# EAGLE design project2 (EAGLE 9.6.2)
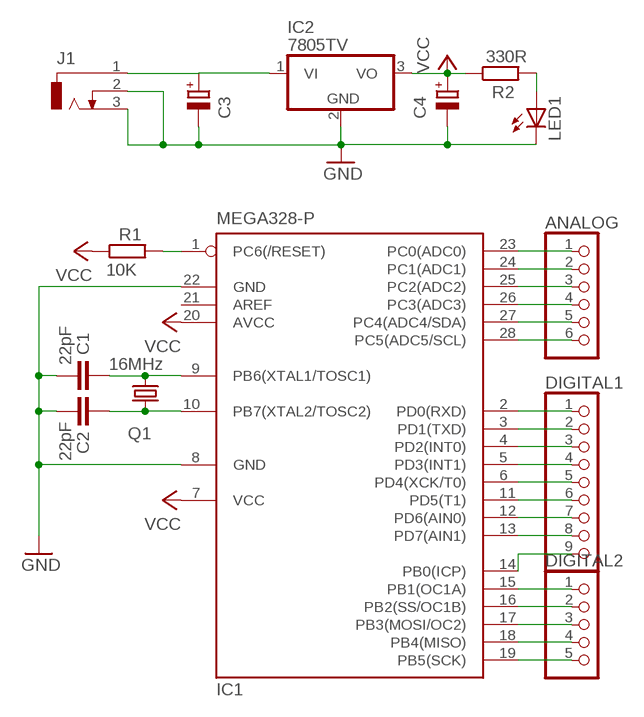
[diagram p0: schematic, sheet 1]

## Parts
ANALOG  PINHD-1X6  [1X06]
C1  22pF  C-EU025-024X044  [C025-024X044]
C2  22pF  C-EU025-024X044  [C025-024X044]
C3  CPOL-EUE2.5-6  [E2,5-6]
C4  CPOL-EUE2.5-6  [E2,5-6]
DIGITAL1  PINHD-1X9  [1X09]
DIGITAL2  PINHD-1X5  [1X05]
IC1  MEGA328-P  MEGA8-P  [DIL28-3]
IC2  7805TV  [TO220V]
J1  DCJ0303  [DCJ0303]
LED1  LED3MM  [LED3MM]
Q1  16MHz  CRYSTALHC49U70  [HC49U70]
R1  10K  R-EU_0207/10  [0207/10]
R2  330R  R-EU_0207/10  [0207/10]

## Nets
GND: C1.2 C2.2 C3.- C4.- IC1.8(GND) IC1.22(GND) IC2.2(GND) J1.2 J1.3 LED1.K(C)
N$1: IC1.1(PC6(/RESET)) R1.2
N$2: C1.1 IC1.9(PB6(XTAL1/TOSC1)) Q1.1
N$3: C2.1 IC1.10(PB7(XTAL2/TOSC2)) Q1.2
N$4: ANALOG.1 IC1.23(PC0(ADC0))
N$5: ANALOG.2 IC1.24(PC1(ADC1))
N$6: ANALOG.3 IC1.25(PC2(ADC2))
N$7: ANALOG.4 IC1.26(PC3(ADC3))
N$8: ANALOG.5 IC1.27(PC4(ADC4/SDA))
N$9: ANALOG.6 IC1.28(PC5(ADC5/SCL))
N$10: DIGITAL1.1 IC1.2(PD0(RXD))
N$11: DIGITAL1.2 IC1.3(PD1(TXD))
N$12: DIGITAL1.3 IC1.4(PD2(INT0))
N$13: DIGITAL1.4 IC1.5(PD3(INT1))
N$14: DIGITAL1.5 IC1.6(PD4(XCK/T0))
N$15: DIGITAL1.6 IC1.11(PD5(T1))
N$16: DIGITAL1.7 IC1.12(PD6(AIN0))
N$17: DIGITAL1.8 IC1.13(PD7(AIN1))
N$18: DIGITAL1.9 IC1.14(PB0(ICP))
N$19: DIGITAL2.1 IC1.15(PB1(OC1A))
N$20: DIGITAL2.2 IC1.16(PB2(SS/OC1B))
N$21: DIGITAL2.3 IC1.17(PB3(MOSI/OC2))
N$22: DIGITAL2.4 IC1.18(PB4(MISO))
N$23: DIGITAL2.5 IC1.19(PB5(SCK))
N$24: C3.+ IC2.1(VI) J1.1
N$28: LED1.A R2.2
VCC: C4.+ IC1.7(VCC) IC1.20(AVCC) IC2.3(VO) R1.1 R2.1
Unconnected: IC1.21(AREF)

## Library data of the parts
ANALOG = pinhead:PINHD-1X6: PIN HEADER
C1 C2 = rcl:C-EU: CAPACITOR, European symbol; SPICEPREFIX: C
C3 C4 = rcl:CPOL-EU: POLARIZED CAPACITOR, European symbol; SPICEPREFIX: C
DIGITAL1 = pinhead:PINHD-1X9: PIN HEADER
DIGITAL2 = pinhead:PINHD-1X5: PIN HEADER
IC1 = atmel:MEGA8-P: MICROCONTROLLER 8 Kbytes FLASH, 1 kbytes SRAM, 512 bytes EEPROM, USART, 4-channel 10 bit ADC, 2-channel 8 bit ADC Pin compatible with Atmega48, ATMega88, ATMega168 Source: avr.lbr; OC_FARNELL: unknown; OC_NEWARK: unknown
IC2 = linear:78*: Positive VOLTAGE REGULATOR Source: http://cache.national.com/ds/LM/LM78L05.pdf http://www.fairchildsemi.com/ds/LM/LM7805.pdf
J1 = con-jack:DCJ0303: DC POWER JACK Source: DCJ0303.pdf; OC_FARNELL: unknown; OC_NEWARK: unknown
LED1 = led:LED: LED OSRAM: - CHIPLED LG R971, LG N971, LY N971, LG Q971, LY Q971, LO R971, LY R971 LH N974, LH R974 LS Q976, LO Q976, LY Q976 LO Q996 - Hyper CHIPLED LW Q18S LB Q993, LB Q99A, LB R99A - SideLED LS A670, LO A670, LY A670, LG A670, LP A670 LB A673, LV A673, LT A673, LW A673 LH A674 LY A675 LS A676, LA A676, LO A676, LY A676, LW A676 LS A679, LY A679, LG A679 - Hyper Micro SIDELED® LS Y876, LA Y876, LO Y876, LY Y876 LT Y87S - SmartLED LW L88C, LW L88S LB L89C, LB L89S, LG L890 LS L89K, LO L89K, LY L89K LS L896, LA L896, LO L896, LY L896 - TOPLED LS T670, LO T670, LY T670, LG T670, LP T670 LSG T670, LSP T670, LSY T670, LOP T670, LYG T670 LG T671, LOG T671, LSG T671 LB T673, LV T673, LT T673, LW T673 LH T674 LS T676, LA T676, LO T676, LY T676, LB T676, LH T676, LSB T676, LW T676 LB T67C, LV T67C, LT T67C, LS T67K, LO T67K, LY T67K, LW E67C LS E67B, LA E67B, LO E67B, LY E67B, LB E67C, LV E67C, LT E67C LW T67C LS T679, LY T679, LG T679 LS T770, LO T770, LY T770, LG T770, LP T770 LB T773, LV T773, LT T773, LW T773 LH T774 LS E675, LA E675, LY E675, LS T675 LS T776, LA T776, LO T776, LY T776, LB T776 LHGB T686 LT T68C, LB T68C - Hyper Mini TOPLED® LB M676 - Mini TOPLED Santana® LG M470 LS M47K, LO M47K, LY M47K Source: http://www.osram.convergy.de LUXEON: - LUMILED® LXK2-PW12-R00, LXK2-PW12-S00, LXK2-PW14-U00, LXK2-PW14-V00 LXK2-PM12-R00, LXK2-PM12-S00, LXK2-PM14-U00 LXK2-PE12-Q00, LXK2-PE12-R00, LXK2-PE12-S00, LXK2-PE14-T00, LXK2-PE14-U00 LXK2-PB12-K00, LXK2-PB12-L00, LXK2-PB12-M00, LXK2-PB14-N00, LXK2-PB14-P00, LXK2-PB14-Q00 LXK2-PR12-L00, LXK2-PR12-M00, LXK2-PR14-Q00, LXK2-PR14-R00 LXK2-PD12-Q00, LXK2-PD12-R00, LXK2-PD12-S00 LXK2-PH12-R00, LXK2-PH12-S00 LXK2-PL12-P00, LXK2-PL12-Q00, LXK2-PL12-R00 Source: www.luxeon.com KINGBRIGHT: KA-3528ASYC Source: www.kingbright.com
Q1 = crystal:CRYSTAL: CRYSTAL; OC_FARNELL: unknown; OC_NEWARK: unknown
R1 R2 = rcl:R-EU_: RESISTOR, European symbol; SPICEPREFIX: R

## Board
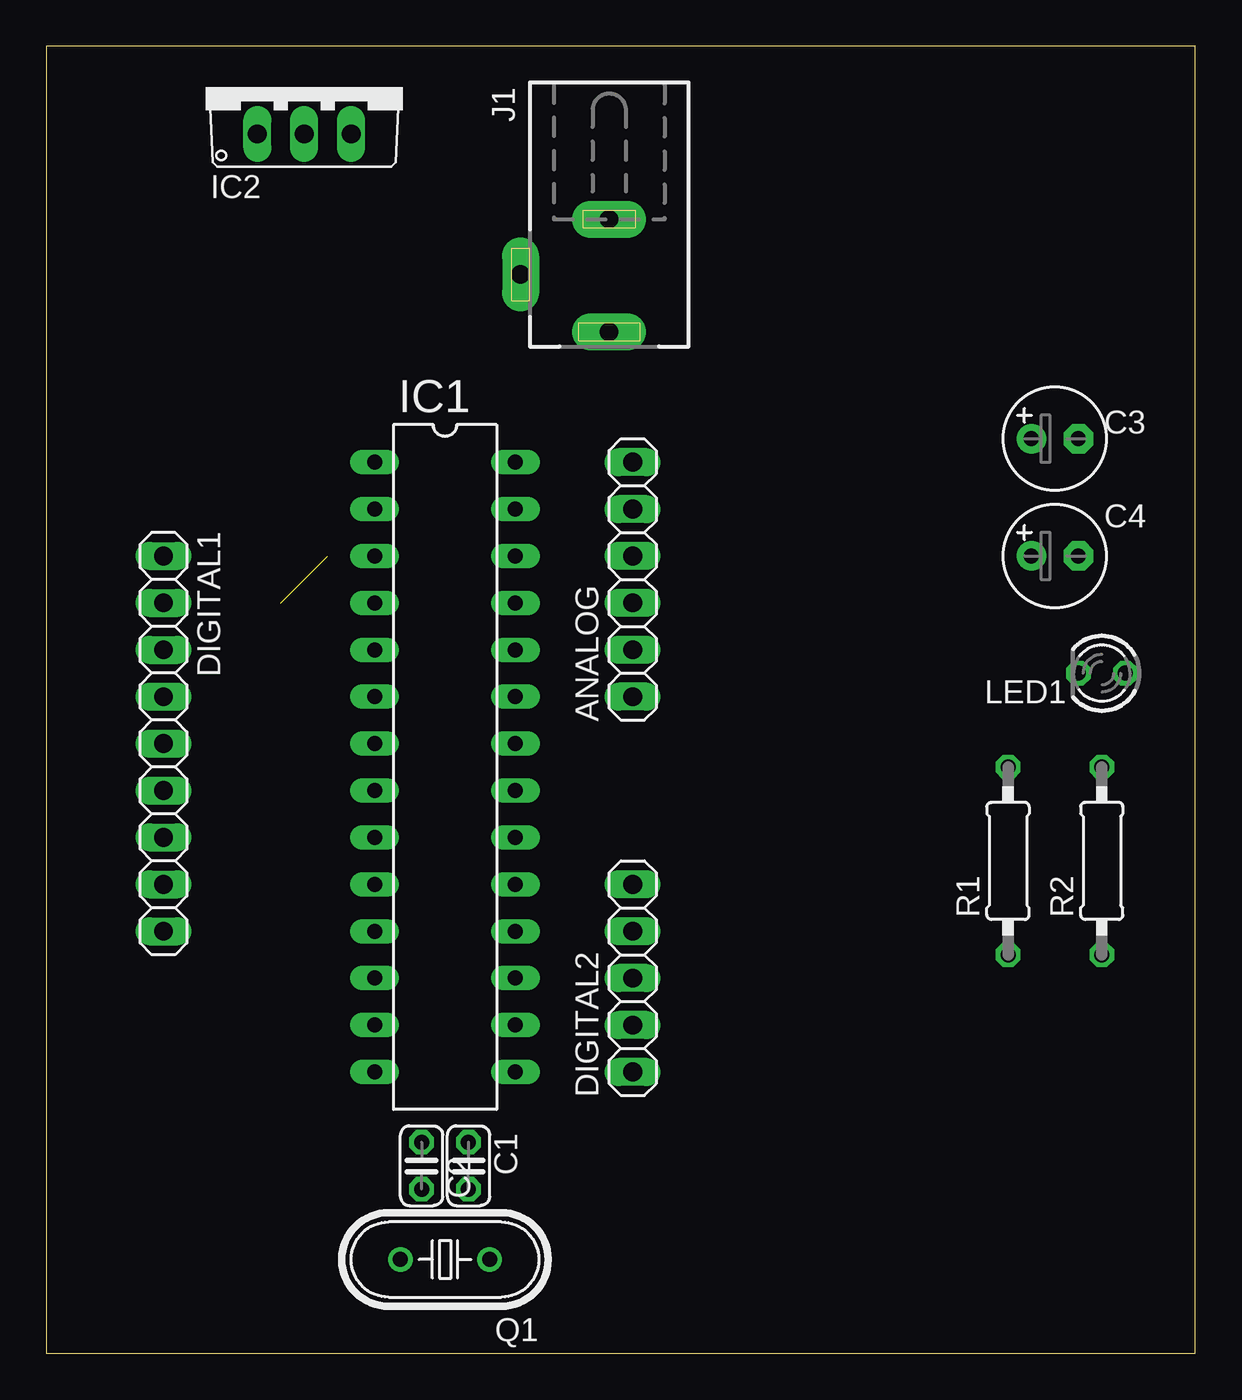
[diagram p1: board, top side]
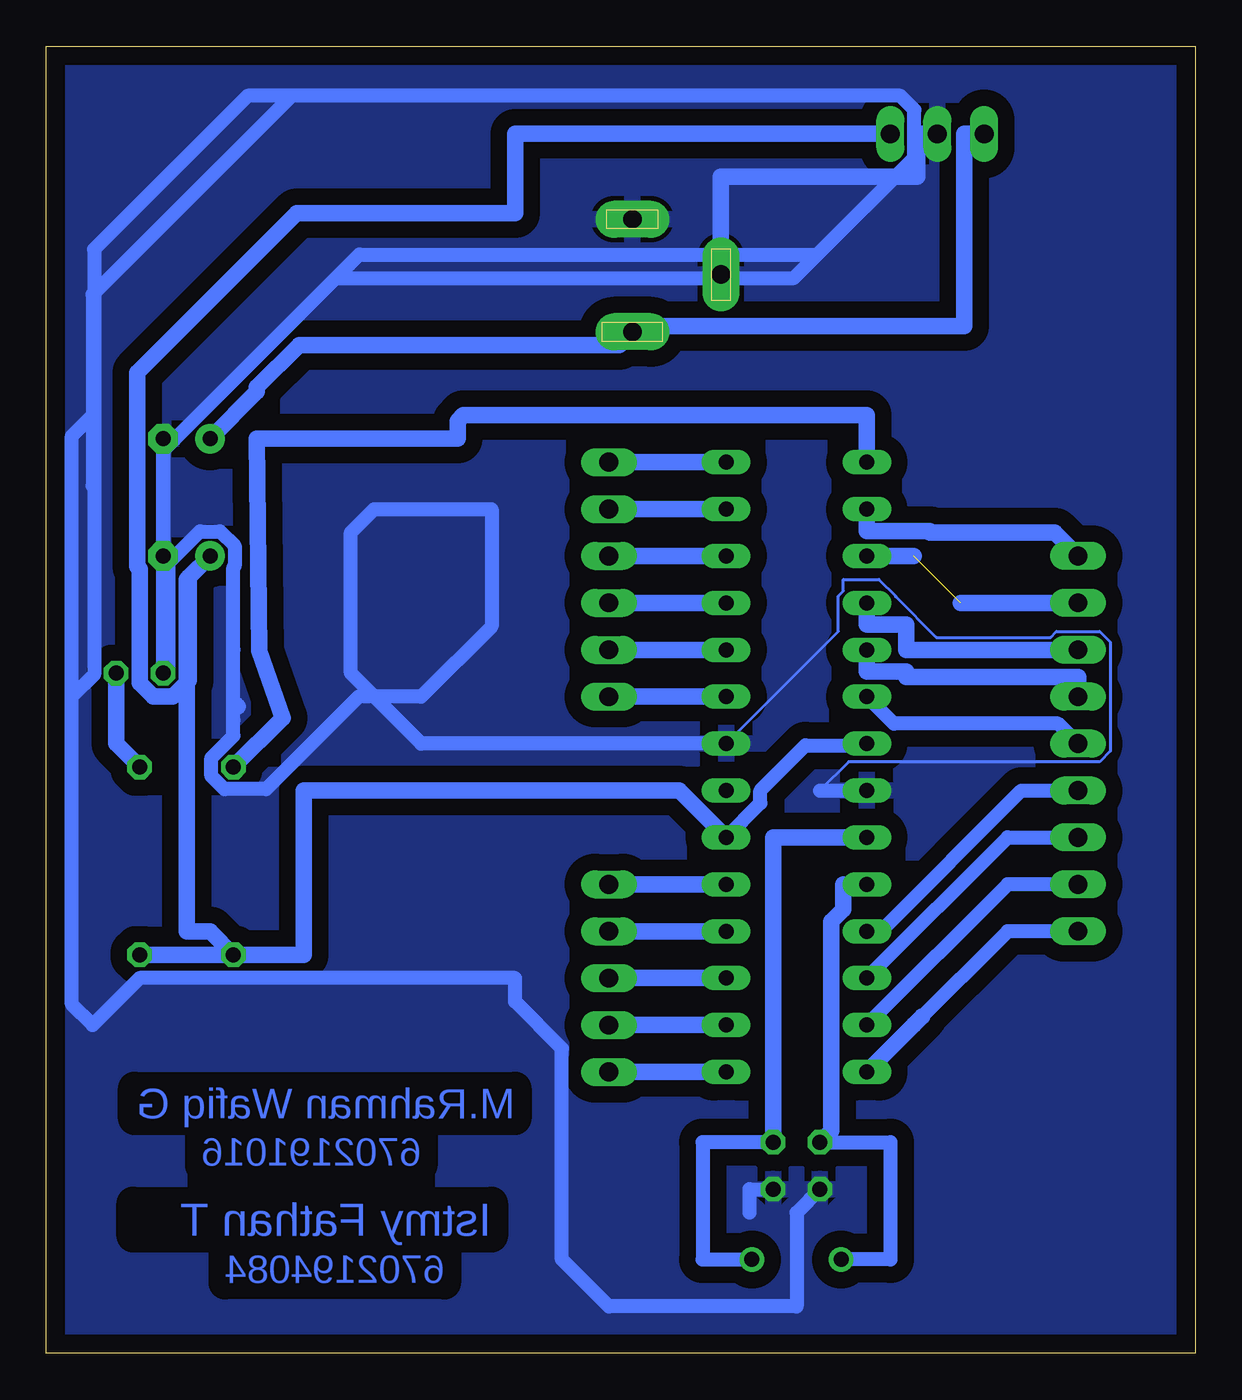
[diagram p2: board, bottom side, seen from below]

Size 62.21 x 70.79 mm. Coordinates in mm from the lower left corner, seen from the top.
Outline: 0,0 62.21,0 62.21,70.79 0,70.79 0,0
Copper layers (1*16): Top 0.035mm / dielectric 1.5mm / Bottom 0.035mm
Design rules "default": minimum track width 6mil, minimum drill 0.35mm, track to track 6mil, track to pad 6mil, pad to pad 6mil, via to via 6mil, smd to smd 6mil, copper to edge 40mil, drill to drill 6mil, minimum pad ring 10mil, minimum via ring 8mil, stop-mask expansion 4mil, vias tented up to drill 0mil, thermal gap 10mil

### Footprints (pad centres in the part's own frame; a part is rotated, then mirrored left to right if it is on the bottom)
1X06 = drill 1.016 long: 1 -6.35,0; 2 -3.81,0; 3 -1.27,0; 4 1.27,0; 5 3.81,0; 6 6.35,0
C025-024X044 = drill 0.813 octagon: 1 -1.27,0; 2 1.27,0
E2,5-6 = drill 0.813 pad 1.6: + -1.27,0 | drill 0.813 pad 1.6 octagon: - 1.27,0
1X09 = drill 1.016 long: 1 -10.16,0; 2 -7.62,0; 3 -5.08,0; 4 -2.54,0; 5 0,0; 6 2.54,0; 7 5.08,0; 8 7.62,0; 9 10.16,0
1X05 = drill 1.016 long: 1 -5.08,0; 2 -2.54,0; 3 0,0; 4 2.54,0; 5 5.08,0
DIL28-3 = drill 0.813 long: 1 -16.51,-3.81; 2 -13.97,-3.81; 3 -11.43,-3.81; 4 -8.89,-3.81; 5 -6.35,-3.81; 6 -3.81,-3.81; 7 -1.27,-3.81; 8 1.27,-3.81; 9 3.81,-3.81; 10 6.35,-3.81; 11 8.89,-3.81; 12 11.43,-3.81; 13 13.97,-3.81; 14 16.51,-3.81; 15 16.51,3.81; 16 13.97,3.81; 17 11.43,3.81; 18 8.89,3.81; 19 6.35,3.81; 20 3.81,3.81; 21 1.27,3.81; 22 -1.27,3.81; 23 -3.81,3.81; 24 -6.35,3.81; 25 -8.89,3.81; 26 -11.43,3.81; 27 -13.97,3.81; 28 -16.51,3.81
TO220V = drill 1.016 long: 1 -2.54,-2.54; 2 0,-2.54; 3 2.54,-2.54
DCJ0303 = drill 1 pad 2 long: 1 0,3.1; 2 4.8,0; 3 0,-3
LED3MM = drill 0.813 octagon: A -1.27,0; K 1.27,0
HC49U70 = drill 0.813: 1 -2.413,0; 2 2.413,0
0207/10 = drill 0.813 octagon: 1 -5.08,0; 2 5.08,0

### Placement (x,y rotation side)
ANALOG  31.75,41.91 90 top
C1  22.86,10.16 270 top
C2  20.32,10.16 270 top
C3  54.61,49.53 0 top
C4  54.61,43.18 0 top
DIGITAL1  6.35,33.02 270 top
DIGITAL2  31.75,20.32 90 top
IC1  21.59,31.75 270 top
IC2  13.97,68.58 0 top
J1  30.48,58.42 180 top
LED1  57.15,36.83 180 top
Q1  21.59,5.08 180 top
R1  52.07,26.67 90 top
R2  57.15,26.67 90 top

### Tracks (layer width: path | path; a pad name or v marks a point on that pad's centre or on a via)
GND
  Bottom 0.152: 20.32,30.48 18.77,32.03 5.18,32.03 4.6,32.61 4.6,38.51 5.18,39.09 7.52,39.09 7.84,38.77 14.02,38.77 16.23,40.98 16.23,41.01 17.13,41.91 19.05,41.91 19.05,41.29 19.33,41.01 19.33,39.09 IC1.22 25.17,33.02 | 52.31,38.34 52.07,38.1 | 52.31,38.34 52.31,43.61 52.91,44.21 53.77,44.21 55.28,42.69 55.28,37.43 LED1.K | 52.07,34.29 52.31,34.53 52.31,38.34
  Bottom 0.762: C3.- C4.- | C4.- 55.23,43.18 | 55.23,43.18 53.89,44.51 52.79,44.51 52.01,43.73 52.01,42.63 52.07,42.56 52.07,38.1 52.07,34.29 52.07,33.44 53.26,32.24 53.26,31.26 52.56,30.56 50.31,30.56 45.3,35.56 41.91,35.56 38.1,39.37 38.1,45.72 44.45,45.72 45.72,44.45 45.72,36.83 41.91,33.02 IC1.22 | 24.13,7.62 24.13,8.89 C1.2 | 20.32,30.48 IC1.8 | 59.69,50.8 59.69,57.34 48.93,68.1 | 59.69,50.8 59.69,46.99 | C4.- 55.88,48.88 46.53,58.23 | 46.53,58.23 21.73,58.23 20.46,59.5 | 59.69,50.8 60.81,49.68 60.81,35.56 | 60.81,35.56 60.81,18.9 59.69,17.78 57.15,20.32 36.83,20.32 36.83,19.05 34.29,16.51 34.29,5.08 31.75,2.54 21.59,2.54 21.59,7.62 C2.2 | 60.81,35.56 59.61,36.76 59.61,59.79 51.3,68.1 48.93,68.1 | 20.46,59.5 45.26,59.5 46.53,58.23 | 20.46,59.5 15.22,64.74 15.22,67.34 15.97,68.1 48.93,68.1 | C4.- LED1.K 55.59,37.12 55.59,42.82 55.23,43.18
  Bottom 0.889: 55.32,49.53 C3.- | 51.94,35.13 51.84,35.03 | IC2.2 15.05,66.04 15.05,63.72 25.68,63.72 J1.2
  pour Bottom (isolate 0.889): 0,71.12 62.23,71.12 62.23,0 0,0
N$1
  Bottom 0.889: IC1.1 17.78,50.8 39.63,50.8 39.93,50.5 39.93,49.53 50.81,49.53 50.67,38.04 49.41,34.41 R1.2
N$2
  Bottom 0.762: C1.1 26.67,11.43 26.67,5.08 Q1.1
  Bottom 0.889: IC1.9 22.86,27.94 C1.1
N$3
  Bottom 0.762: C2.1 16.51,11.43 16.51,5.08 Q1.2 | IC1.10 19.05,25.4
  Bottom 0.889: C2.1 19.7,12.05 19.7,23.38 19.05,24.03 19.05,25.4
N$4
  Bottom 0.889: IC1.23 ANALOG.1
N$5
  Bottom 0.889: ANALOG.2 IC1.24
N$6
  Bottom 0.889: IC1.25 ANALOG.3
N$7
  Bottom 0.889: ANALOG.4 IC1.26
N$8
  Bottom 0.889: ANALOG.5 IC1.27
N$9
  Bottom 0.889: ANALOG.6 IC1.28
N$10
  Bottom 0.889: DIGITAL1.1 7.62,44.45 14.39,44.45 14.39,44.54 17.78,44.54 IC1.2
N$11  (1 unrouted)
  Bottom 0.889: DIGITAL1.2 12.7,40.64 | 15.24,43.18 IC1.3
N$12
  Bottom 0.889: DIGITAL1.3 15.66,38.1 15.66,39.46 17.78,39.46 IC1.4
N$13
  Bottom 0.889: DIGITAL1.4 6.35,36.64 15.66,36.64 15.66,36.92 17.78,36.92 IC1.5
N$14
  Bottom 0.762: IC1.6 16.32,34.1 7.43,34.1 DIGITAL1.5
N$15
  Bottom 0.762: DIGITAL1.6 9.41,30.48 17.03,22.86 IC1.11
N$16
  Bottom 0.762: IC1.12 10.16,27.94 DIGITAL1.7
N$17
  Bottom 0.762: DIGITAL1.8 10.16,25.4 IC1.13
N$18
  Bottom 0.762: DIGITAL1.9 10.16,22.86 15.24,17.78
  Bottom 0.889: 14.78,18.24 15.24,17.78 IC1.14
N$19
  Bottom 0.889: IC1.15 DIGITAL2.1
N$20
  Bottom 0.889: IC1.16 DIGITAL2.2
N$21
  Bottom 0.889: IC1.17 DIGITAL2.3
N$22
  Bottom 0.889: DIGITAL2.4 IC1.18
N$23
  Bottom 0.889: DIGITAL2.5 IC1.19
N$24
  Bottom 0.889: C3.+ 50.8,52.07 50.8,52.33 48.52,54.61 31.19,54.61 J1.1 30.48,55.62 12.51,55.62 12.51,66.04 IC2.1
N$28
  Bottom 0.889: LED1.A 58.42,33.02 R2.2
VCC
  Bottom 0.762: IC1.20 23.55,29.79 23.55,30.48 21.11,32.92 17.78,32.92
  Bottom 0.889: R2.1 R1.1 | 17.78,32.92 IC1.7 | IC1.20 27.94,30.48 48.26,30.48 48.26,21.59 R1.1 | R1.1 53.34,22.86 54.61,22.86 54.61,41.91 C4.+ 54.48,42.04 54.48,36.45 55.36,35.57 56.4,35.57 57.14,36.31 57.14,42.46 57.28,42.6 57.28,53.12 48.65,61.75 36.83,61.75 36.83,66.04 IC2.3

### Text on the board
Bottom: M.Rahman Wafiq G | 6702191016 | Istmy Fathan T | 6702194084